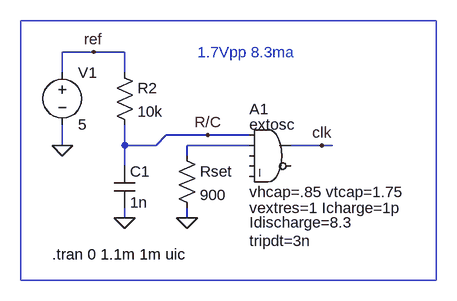
[diagram p0: schematic oscillator_test_A.asc]
oscillator_test_A.asc, the LTspice schematic file:
Version 4
SHEET 1 1060 680
WIRE 192 272 240 272
WIRE 240 272 256 272
WIRE -64 368 -64 384
WIRE 32 368 32 384
WIRE 128 272 32 272
WIRE -64 272 -64 240
WIRE -64 160 -64 128
WIRE -64 128 -112 128
WIRE -112 128 -160 128
WIRE 32 272 32 288
WIRE -64 304 -64 272
WIRE -160 272 -160 240
WIRE -160 160 -160 128
WIRE 64 256 128 256
WIRE 0 256 64 256
WIRE -64 272 -16 272
WIRE -16 272 0 256
FLAG 240 272 clk
FLAG -64 384 0
FLAG -112 128 ref
FLAG -160 272 0
FLAG 64 256 R/C
FLAG 32 384 0
SYMBOL Digital\\and 160 224 R0
WINDOW 38 -32 16 Left 0
WINDOW 3 -32 120 Left 0
WINDOW 123 -32 144 Left 0
WINDOW 0 -32 -8 Left 0
WINDOW 39 -32 167 Left 0
WINDOW 40 -32 195 Left 0
SYMATTR SpiceModel extosc
SYMATTR Value vhcap=.85 vtcap=1.75
SYMATTR Value2 vextres=1 Icharge=1p
SYMATTR InstName A1
SYMATTR SpiceLine Idischarge=8.3
SYMATTR SpiceLine2 tripdt=3n
SYMBOL cap -80 304 R0
SYMATTR InstName C1
SYMATTR Value 1n
SYMBOL res 16 272 R0
SYMATTR InstName Rset
SYMATTR Value 900
SYMBOL res -80 144 R0
SYMATTR InstName R2
SYMATTR Value 10k
SYMBOL voltage -160 144 R0
SYMATTR InstName V1
SYMATTR Value 5
TEXT 48 128 Left 0 ;1.7Vpp 8.3ma
TEXT -176 440 Left 0 !.tran 0 1.1m 1m uic
RECTANGLE Normal 416 480 -224 80

The netlist it stands for:
* oscillator_test_A.asc
A1 R/C N001 0 0 0 0 clk 0 extosc vhcap=.85 vtcap=1.75 vextres=1 Icharge=1p Idischarge=8.3 tripdt=3n
C1 R/C 0 1n
Rset N001 0 900
R2 ref R/C 10k
V1 ref 0 5
* 1.7Vpp 8.3ma
.tran 0 1.1m 1m uic
.backanno
.end